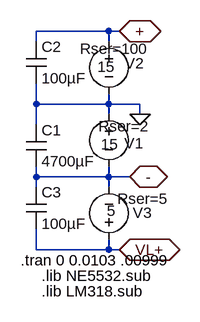
[diagram p0: schematic surfmaster_pi.asc]
surfmaster_pi.asc, the LTspice schematic file:
Version 4
SHEET 1 880 680
WIRE 16 -176 -96 -176
WIRE 32 -176 16 -176
WIRE -96 -160 -96 -176
WIRE 16 -160 16 -176
WIRE -96 -64 -96 -96
WIRE 16 -64 16 -80
WIRE 16 -64 -96 -64
WIRE 64 -64 16 -64
WIRE 16 -48 16 -64
WIRE 64 -48 64 -64
WIRE -96 -32 -96 -64
WIRE -96 48 -96 32
WIRE 16 48 16 32
WIRE 16 48 -96 48
WIRE 48 48 16 48
WIRE -96 64 -96 48
WIRE 16 64 16 48
WIRE -96 160 -96 128
WIRE 16 160 16 144
WIRE 16 160 -96 160
WIRE 32 160 16 160
FLAG 48 48 -
IOPIN 48 48 BiDir
FLAG 32 -176 +
IOPIN 32 -176 BiDir
FLAG 64 -48 0
FLAG 32 160 VL+
IOPIN 32 160 BiDir
SYMBOL voltage 16 -64 M0
WINDOW 123 0 0 Left 2
WINDOW 39 -63 34 Left 2
WINDOW 0 -53 60 Left 2
WINDOW 3 -15 62 Left 2
SYMATTR SpiceLine Rser=2
SYMATTR InstName V1
SYMATTR Value 15
SYMBOL voltage 16 -176 M0
WINDOW 123 0 0 Left 2
WINDOW 39 -61 27 Left 2
WINDOW 0 -54 49 Left 2
WINDOW 3 -9 55 Left 2
SYMATTR SpiceLine Rser=100
SYMATTR InstName V2
SYMATTR Value 15
SYMBOL voltage 16 160 M180
WINDOW 123 0 0 Left 2
WINDOW 39 13 78 Left 2
WINDOW 0 37 57 Left 2
WINDOW 3 -3 60 Left 2
SYMATTR SpiceLine Rser=5
SYMATTR InstName V3
SYMATTR Value 5
SYMBOL Misc\\EuropeanCap -112 -32 R0
SYMATTR InstName C1
SYMATTR Value 4700µF
SYMATTR SpiceLine V=400 Irms=1 Rser=.32 Lser=0
SYMBOL Misc\\EuropeanCap -112 -160 R0
SYMATTR InstName C2
SYMATTR Value 100µF
SYMATTR SpiceLine V=400 Irms=1 Rser=.32 Lser=0
SYMBOL Misc\\EuropeanCap -112 64 R0
SYMATTR InstName C3
SYMATTR Value 100µF
SYMATTR SpiceLine V=400 Irms=1 Rser=.32 Lser=0
TEXT -120 176 Left 2 !.tran 0 0.0103 .00999
TEXT -88 200 Left 2 !.lib NE5532.sub
TEXT -88 224 Left 2 !.lib LM318.sub

The netlist it stands for:
* surfmaster_pi.asc
V1 0 - 15 Rser=2
V2 + 0 15 Rser=100
V3 VL+ - 5 Rser=5
C1 0 - 4700µF V=400 Irms=1 Rser=.32 Lser=0
C2 + 0 100µF V=400 Irms=1 Rser=.32 Lser=0
C3 - VL+ 100µF V=400 Irms=1 Rser=.32 Lser=0
.tran 0 0.0103 .00999
.lib NE5532.sub
.lib LM318.sub
.backanno
.end